# Altium project s.PrjPcb
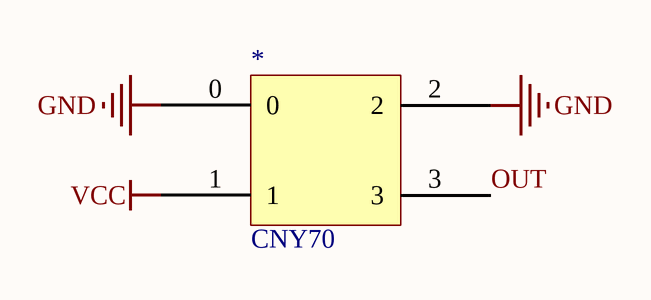
[diagram p0: Sensor shoot.SchDoc]
1 sheet, 1 parts. Net scope: global (net labels, ports and power ports of the same name join across sheets).

## Sheet Sensor shoot.SchDoc
size A

### Parts
*  CNY70  [CNY70]

### Nets
GND: *.0 *.2
VCC: *.1
OUT: *.3